# Altium schematic sheet USBC_Hub1.SchDoc
size A3; SheetNumber: 1; SheetTotal: 4
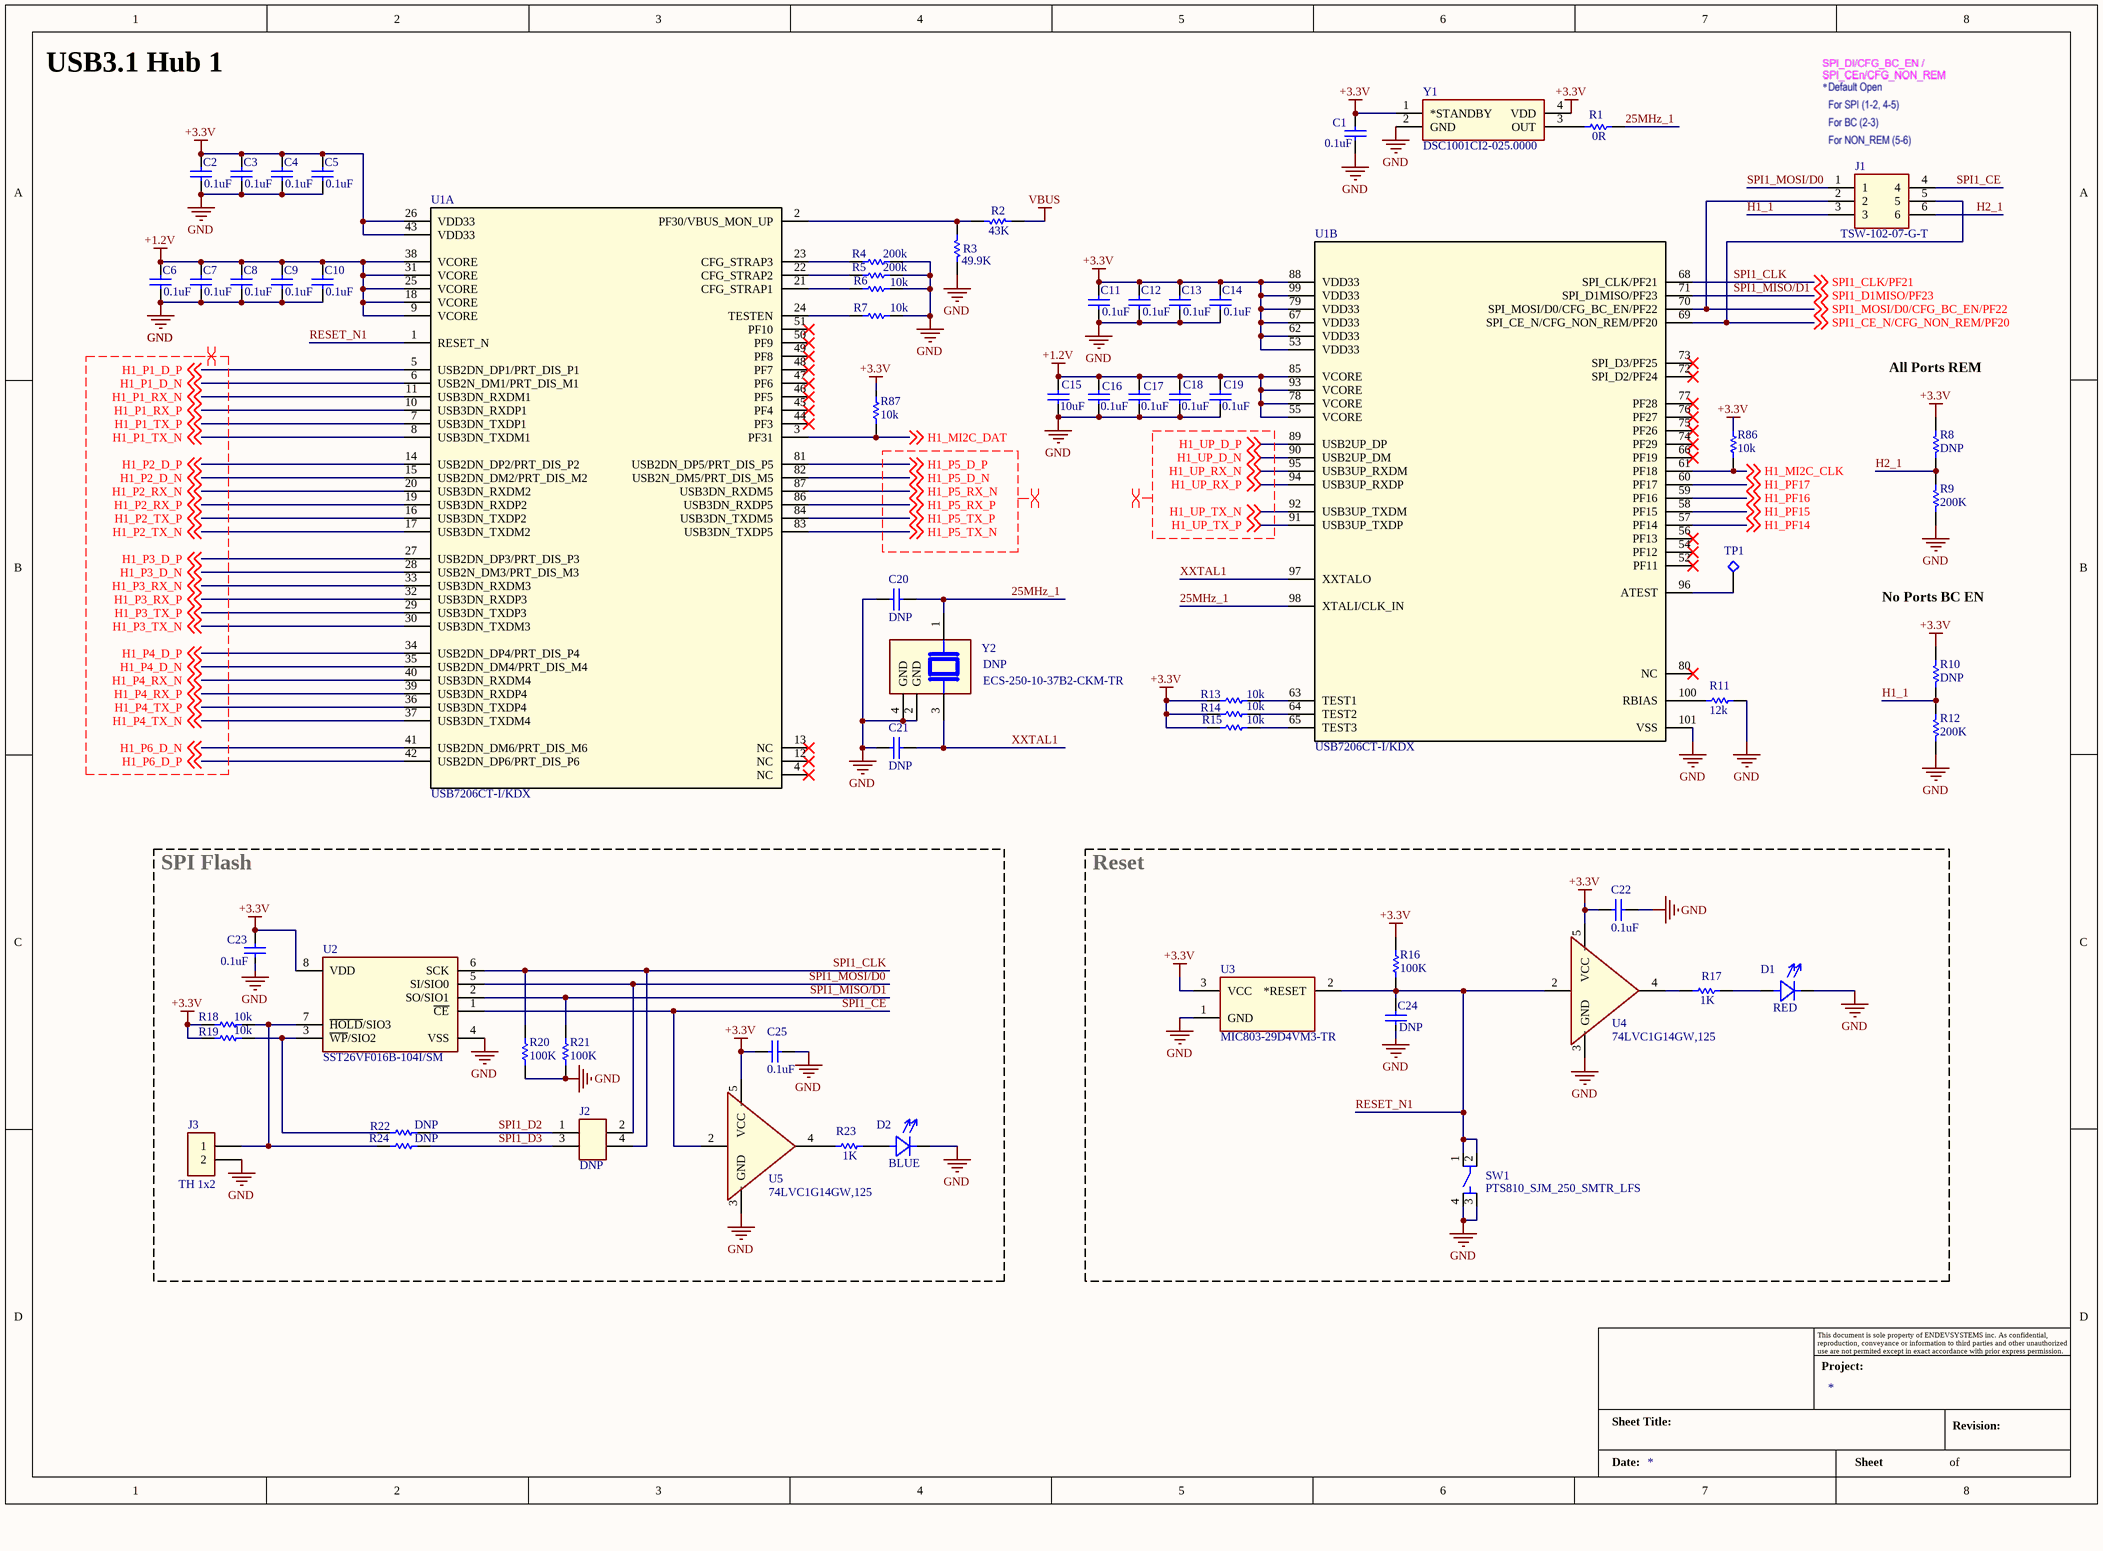
[diagram p0: USBC_Hub1.SchDoc]

## Parts
?  Title_Block  (value not drawn)  (graphical)
C1  0.1uF  [C-0402/1005]
C2  0.1uF  [C-0402/1005]
C3  0.1uF  [C-0402/1005]
C4  0.1uF  [C-0402/1005]
C5  0.1uF  [C-0402/1005]
C6  0.1uF  [C-0402/1005]
C7  0.1uF  [C-0402/1005]
C8  0.1uF  [C-0402/1005]
C9  0.1uF  [C-0402/1005]
C10  0.1uF  [C-0402/1005]
C11  0.1uF  [C-0402/1005]
C12  0.1uF  [C-0402/1005]
C13  0.1uF  [C-0402/1005]
C14  0.1uF  [C-0402/1005]
C15  10uF  [C-0805/2012]
C16  0.1uF  [C-0402/1005]
C17  0.1uF  [C-0402/1005]
C18  0.1uF  [C-0402/1005]
C19  0.1uF  [C-0402/1005]
C20  DNP  [R-0402/1005]
C21  DNP  [R-0402/1005]
C22  0.1uF  [C-0402/1005]
C23  0.1uF  [C-0402/1005]
C24  value DNP  [C-0402/1005]  (hidden comment: 0.1uF)
C25  0.1uF  [C-0402/1005]
D1  RED  [LEDC1608X65N]
D2  BLUE  [LEDC1608X65N]
J1  TSW-102-07-G-T  [CON6_3X2_TU_TSW_SAI]
J2  DNP  [PIN HEADER 2x2 2.54mm]
J3  TH 1x2  [PIN HEADER 1x2 2.54mm]
R1  0R  [R-0402/1005]
R2  43K  [R-0402/1005]
R3  49.9K  [R-0402/1005]
R4  200k  [R-0402/1005]
R5  200k  [R-0402/1005]
R6  10k  [R-0402/1005]
R7  10k  [R-0402/1005]
R8  DNP  [R-0402/1005]
R9  200K  [R-0402/1005]
R10  DNP  [R-0402/1005]
R11  12k  [R-0402/1005]
R12  200K  [R-0402/1005]
R13  10k  [R-0402/1005]
R14  10k  [R-0402/1005]
R15  10k  [R-0402/1005]
R16  100K  [R-0402/1005]
R17  1K  [R-0402/1005]
R18  10k  [R-0402/1005]
R19  10k  [R-0402/1005]
R20  100K  [R-0402/1005]
R21  100K  [R-0402/1005]
R22  DNP  [R-0402/1005]
R23  1K  [R-0402/1005]
R24  DNP  [R-0402/1005]
R86  10k  [R-0402/1005]
R87  10k  [R-0402/1005]
SW1  PTS810_SJM_250_SMTR_LFS  [SW_PTS810_SJM_250_SMTR_LFS]
TP1  Test Points  [Test Point TH Round H0.9,D1.6]  (value not drawn)
U1  USB7206CT-I/KDX  [USB7206]  (parts A,B of 2)
U2  SST26VF016B-104I/SM  [SOIC127P794X203-8N]
U3  MIC803-29D4VM3-TR  [SOT-23_M3_MCH]
U4  74LVC1G14GW,125  [SOT65P212X110-5N]
U5  74LVC1G14GW,125  [SOT65P212X110-5N]
Y1  DSC1001CI2-025.0000  [CDFN4_3P2X2P5_MCH]
Y2  DNP  [ECS-250-10-37B2]

## Blocks framed on the sheet
SPI Flash: C23 C25 D2 J2 J3 R18-R24 U2 U5
Reset: C22 C24 D1 R16 R17 SW1 U3 U4

## Nets
+1.2V: C6.2 C7.2 C8.2 C9.2 C10.2 C15.2 C16.1 C17.1 C18.2 C19.2 U1.9(VCORE) U1.18(VCORE) U1.25(VCORE) U1.31(VCORE) U1.38(VCORE) U1.55(VCORE) U1.78(VCORE) U1.85(VCORE) U1.93(VCORE)
+3.3V: C1.2 C2.2 C3.2 C4.2 C5.2 C11.2 C12.2 C13.2 C14.2 C22.2 C23.2 C25.2 R8.2 R10.2 R13.2 R14.2 R15.2 R16.1 R18.2 R19.2 R86.1 R87.1 U1.26(VDD33) U1.43(VDD33) U1.53(VDD33) U1.62(VDD33) U1.67(VDD33) U1.79(VDD33) U1.88(VDD33) U1.99(VDD33) U2.8(VDD) U3.3(VCC) U4.5(VCC) U5.5(VCC) Y1.1(*STANDBY) Y1.4(VDD)
GND: C1.1 C2.1 C3.1 C4.1 C5.1 C6.1 C7.1 C8.1 C9.1 C10.1 C11.1 C12.1 C13.1 C14.1 C15.1 C16.2 C17.2 C18.1 C19.1 C20.2 C21.2 C22.1 C23.1 C24.1 C25.1 D1.C D2.C J3.2 R3.2 R4.2 R5.2 R6.2 R7.1 R9.1 R11.1 R12.1 R20.2 R21.2 SW1.3 SW1.4 U1.101(VSS) U2.4(VSS) U3.1(GND) U4.3(GND) U5.3(GND) Y1.2(GND) Y2.2(GND) Y2.4(GND)
VBUS: R2.2
25MHz_1: C20.1 R1.2 U1.98(XTALI/CLK_IN) Y2.1
H1_1: J1.3 R10.1 R12.2
H1_MI2C_CLK: R86.2 U1.61(PF18) ; off-sheet H1_MI2C_CLK
H1_MI2C_DAT: R87.2 U1.3(PF31) ; off-sheet H1_MI2C_DAT
H1_P1_D_N: U1.6(USB2N_DM1/PRT_DIS_M1) ; off-sheet H1_P1_D_N
H1_P1_D_P: U1.5(USB2DN_DP1/PRT_DIS_P1) ; off-sheet H1_P1_D_P
H1_P1_RX_N: U1.11(USB3DN_RXDM1) ; off-sheet H1_P1_RX_N
H1_P1_RX_P: U1.10(USB3DN_RXDP1) ; off-sheet H1_P1_RX_P
H1_P1_TX_N: U1.8(USB3DN_TXDM1) ; off-sheet H1_P1_TX_N
H1_P1_TX_P: U1.7(USB3DN_TXDP1) ; off-sheet H1_P1_TX_P
H1_P2_D_N: U1.15(USB2DN_DM2/PRT_DIS_M2) ; off-sheet H1_P2_D_N
H1_P2_D_P: U1.14(USB2DN_DP2/PRT_DIS_P2) ; off-sheet H1_P2_D_P
H1_P2_RX_N: U1.20(USB3DN_RXDM2) ; off-sheet H1_P2_RX_N
H1_P2_RX_P: U1.19(USB3DN_RXDP2) ; off-sheet H1_P2_RX_P
H1_P2_TX_N: U1.17(USB3DN_TXDM2) ; off-sheet H1_P2_TX_N
H1_P2_TX_P: U1.16(USB3DN_TXDP2) ; off-sheet H1_P2_TX_P
H1_P3_D_N: U1.28(USB2N_DM3/PRT_DIS_M3) ; off-sheet H1_P3_D_N
H1_P3_D_P: U1.27(USB2DN_DP3/PRT_DIS_P3) ; off-sheet H1_P3_D_P
H1_P3_RX_N: U1.33(USB3DN_RXDM3) ; off-sheet H1_P3_RX_N
H1_P3_RX_P: U1.32(USB3DN_RXDP3) ; off-sheet H1_P3_RX_P
H1_P3_TX_N: U1.30(USB3DN_TXDM3) ; off-sheet H1_P3_TX_N
H1_P3_TX_P: U1.29(USB3DN_TXDP3) ; off-sheet H1_P3_TX_P
H1_P4_D_N: U1.35(USB2DN_DM4/PRT_DIS_M4) ; off-sheet H1_P4_D_N
H1_P4_D_P: U1.34(USB2DN_DP4/PRT_DIS_P4) ; off-sheet H1_P4_D_P
H1_P4_RX_N: U1.40(USB3DN_RXDM4) ; off-sheet H1_P4_RX_N
H1_P4_RX_P: U1.39(USB3DN_RXDP4) ; off-sheet H1_P4_RX_P
H1_P4_TX_N: U1.37(USB3DN_TXDM4) ; off-sheet H1_P4_TX_N
H1_P4_TX_P: U1.36(USB3DN_TXDP4) ; off-sheet H1_P4_TX_P
H1_P5_D_N: U1.82(USB2N_DM5/PRT_DIS_M5) ; off-sheet H1_P5_D_N
H1_P5_D_P: U1.81(USB2DN_DP5/PRT_DIS_P5) ; off-sheet H1_P5_D_P
H1_P5_RX_N: U1.87(USB3DN_RXDM5) ; off-sheet H1_P5_RX_N
H1_P5_RX_P: U1.86(USB3DN_RXDP5) ; off-sheet H1_P5_RX_P
H1_P5_TX_N: U1.83(USB3DN_TXDP5) ; off-sheet H1_P5_TX_N
H1_P5_TX_P: U1.84(USB3DN_TXDM5) ; off-sheet H1_P5_TX_P
H1_P6_D_N: U1.41(USB2DN_DM6/PRT_DIS_M6) ; off-sheet H1_P6_D_N
H1_P6_D_P: U1.42(USB2DN_DP6/PRT_DIS_P6) ; off-sheet H1_P6_D_P
H1_PF14: U1.57(PF14) ; off-sheet H1_PF14
H1_PF15: U1.58(PF15) ; off-sheet H1_PF15
H1_PF16: U1.59(PF16) ; off-sheet H1_PF16
H1_PF17: U1.60(PF17) ; off-sheet H1_PF17
H1_UP_D_N: U1.90(USB2UP_DM) ; off-sheet H1_UP_D_N
H1_UP_D_P: U1.89(USB2UP_DP) ; off-sheet H1_UP_D_P
H1_UP_RX_N: U1.95(USB3UP_RXDM) ; off-sheet H1_UP_RX_N
H1_UP_RX_P: U1.94(USB3UP_RXDP) ; off-sheet H1_UP_RX_P
H1_UP_TX_N: U1.92(USB3UP_TXDM) ; off-sheet H1_UP_TX_N
H1_UP_TX_P: U1.91(USB3UP_TXDP) ; off-sheet H1_UP_TX_P
H2_1: J1.6 R8.1 R9.2
RESET_N1: C24.2 R16.2 SW1.1 SW1.2 U1.1(RESET_N) U3.2(*RESET) U4.2(A)
SPI1_CE: J1.4 U2.1(~{CE}) U5.2(A)
SPI1_CE_N/CFG_NON_REM/PF20: J1.5 U1.69(SPI_CE_N/CFG_NON_REM/PF20) ; off-sheet SPI1_CE_N/CFG_NON_REM/PF20
SPI1_CLK: J2.4 R20.1 U1.68(SPI_CLK/PF21) U2.6(SCK) ; off-sheet SPI1_CLK/PF21  [also labelled SPI1_CLK/PF21]
SPI1_D2: J2.1 R22.2
SPI1_D3: J2.3 R24.2
SPI1_MISO/D1: R21.1 U1.71(SPI_D1MISO/PF23) U2.2(SO/SIO1) ; off-sheet SPI1_D1MISO/PF23  [also labelled SPI1_D1MISO/PF23]
SPI1_MOSI/D0: J1.1 J2.2 U2.5(SI/SIO0)
SPI1_MOSI/D0/CFG_BC_EN/PF22: J1.2 U1.70(SPI_MOSI/D0/CFG_BC_EN/PF22) ; off-sheet SPI1_MOSI/D0/CFG_BC_EN/PF22
XXTAL1: C21.1 U1.97(XXTALO) Y2.3
NetD1_A: D1.A R17.1
NetD2_A: D2.A R23.1
NetJ3_1: J3.1 R18.1 R24.1 U2.7(~{HOLD}/SIO3)
NetR1_1: R1.1 Y1.3(OUT)
NetR2_1: R2.1 R3.1 U1.2(PF30/VBUS_MON_UP)
NetR4_1: R4.1 U1.23(CFG_STRAP3)
NetR5_1: R5.1 U1.22(CFG_STRAP2)
NetR6_1: R6.1 U1.21(CFG_STRAP1)
NetR7_2: R7.2 U1.24(TESTEN)
NetR11_2: R11.2 U1.100(RBIAS)
NetR13_1: R13.1 U1.63(TEST1)
NetR14_1: R14.1 U1.64(TEST2)
NetR15_1: R15.1 U1.65(TEST3)
NetR17_2: R17.2 U4.4(~{Y})
NetR19_1: R19.1 R22.1 U2.3(~{WP}/SIO2)
NetR23_2: R23.2 U5.4(~{Y})
NetTP1_1: TP1.1 U1.96(ATEST)

Not connected (* = marked no-connect by the designer): U1 4(NC)* 12(NC)* 13(NC)* 44(PF3)* 45(PF4)* 46(PF5)* 47(PF6)* 48(PF7)* 49(PF8)* 50(PF9)* 51(PF10)* 52(PF11)* 54(PF12)* 56(PF13)* 66(PF19)* 72(SPI_D2/PF24)* 73(SPI_D3/PF25)* 74(PF29)* 75(PF26)* 76(PF27)* 77(PF28)* 80(NC)*

## Layout directives
differential pair; differential pair class Diff_90R: H1_P1_D_N, H1_P1_D_P, H1_P1_RX_N, H1_P1_RX_P, H1_P1_TX_N, H1_P1_TX_P, H1_P2_D_N, H1_P2_D_P, H1_P2_RX_N, H1_P2_RX_P, H1_P2_TX_N, H1_P2_TX_P, H1_P3_D_N, H1_P3_D_P, H1_P3_RX_N, H1_P3_RX_P, H1_P3_TX_N, H1_P3_TX_P, H1_P4_D_N, H1_P4_D_P, H1_P4_RX_N, H1_P4_RX_P, H1_P4_TX_N, H1_P4_TX_P, H1_P5_D_N, H1_P5_D_P, H1_P5_RX_N, H1_P5_RX_P, H1_P5_TX_N, H1_P5_TX_P, H1_P6_D_N, H1_P6_D_P, H1_UP_D_N, H1_UP_D_P, H1_UP_RX_N, H1_UP_RX_P, H1_UP_TX_N, H1_UP_TX_P

## Notes on the sheet
- USB3.1 Hub 1
- All Ports REM
- No Ports BC EN
- (in symbol Title_Block) This document is sole property of ENDEVSYSTEMS inc. As confidential, reproduction, conveyance or information to third parties and other unauthorized use are not permited except in exact accordance with prior express permission.; Project:; Sheet Title:; Revision:; Date:; Sheet; of

## Library data of the parts
C1-C19 C22-C25 = Cap: Capacitor; Published: 8-Jun-2000; LatestRevisionDate: 17-Jul-2002; LatestRevisionNote: Re-released for DXP Platform.; PackageReference: RAD-0.3; Publisher: Altium Limited; PackageDescription: Radial Cap, Thru-Hole; 2 Leads; 0.3 in Pin Spacing
  C1-C14 C16-C19 C22 C23 C25: Value: 0.1uF
  C15: Value: 10uF
C20 C21 = Cap: Capacitor; Value: 0.1uF; Published: 8-Jun-2000; LatestRevisionDate: 17-Jul-2002; LatestRevisionNote: Re-released for DXP Platform.; PackageReference: RAD-0.3; Publisher: Altium Limited; PackageDescription: Radial Cap, Thru-Hole; 2 Leads; 0.3 in Pin Spacing
D1 D2 = Diode-LED: Supplier: Digikey Electronics
J1 = TSW-102-07-G-T: No Description Available; Mfr_Name: Samtec Inc; Copyright: Copyright (C) 2023 Ultra Librarian. All rights reserved.; Manufacturer_Part_Number: TSW-102-07-G-T; Digi-Key_Part_Number_1: TSW-102-07-G-T-ND; RefDes: RefDes; Type: DEV
J2 = Header 2x2: FIXED IND 22UH 620MA 350 MOHM; Mfr. Part No.: PH2-04-UA; Unit Price (USD): 0.1; Supplier Part No.: 2057-PH2-04-UA-ND; Supplier: Digikey Electronics
J3 = Header 1x2: CONN HEADER VERT 3POS 2.54MM; Mfr. Part No.: 75160-156-03LF; Value: 51R; Unit Price (USD): 0.74; Supplier Part No.: 609-75160-156-03LF-ND; Supplier: Digikey Electronics
R1 R22 R24 = Res1: Resistor; Value: 200K; Published: 8-Jun-2000; LatestRevisionDate: 17-Jul-2002; LatestRevisionNote: Re-released for DXP Platform.; PackageReference: AXIAL-0.3; Publisher: Altium Limited; PackageDescription: Axial Device, Thru-Hole; 2 Leads; 0.3 in Pin Spacing
R2 R3 R8-R12 R16 R17 R20 R21 R23 = Res1: Resistor; Value: 10K; Published: 8-Jun-2000; LatestRevisionDate: 17-Jul-2002; LatestRevisionNote: Re-released for DXP Platform.; PackageReference: AXIAL-0.3; Publisher: Altium Limited; PackageDescription: Axial Device, Thru-Hole; 2 Leads; 0.3 in Pin Spacing
R4-R7 R13-R15 R18 R19 R86 R87 = Res1: Resistor; Published: 8-Jun-2000; LatestRevisionDate: 17-Jul-2002; LatestRevisionNote: Re-released for DXP Platform.; PackageReference: AXIAL-0.3; Publisher: Altium Limited; PackageDescription: Axial Device, Thru-Hole; 2 Leads; 0.3 in Pin Spacing
  R4 R5: Value: 200K
  R6 R7 R13-R15 R18 R19 R86 R87: Value: 10K
SW1 = PTS810_SJM_250_SMTR_LFS: Tactile Switch SPST-NO Top Actuated Surface Mount; MF: C&K; MP: PTS810 SJM 250 SMTR LFS; Price: None; Package: None; Availability: Unavailable; Value: *; SnapEDA_Link: https://www.snapeda.com/parts/PTS810%20SJM%20250%20SMTR%20LFS/C%26K/view-part/522770/?ref=snap
U1 = USB7206: IC USB3.1 GEN2 HUB TYPE C; Manufacturer: Microchip Technology; Manufacturer Product Number: USB7206CT-I/KDX; Digi-Key Part Number: 150-USB7206CT-I/KDXTR-ND; Unit Price: $12.9; Stock: 4935
U3 = MIC803-29D4VM3-TR: No Description Available; Mfr_Name: Microchip; Copyright: Copyright (C) 2023 Ultra Librarian. All rights reserved.; Manufacturer_Part_Number: MIC803-29D4VM3-TR; Digi-Key_Part_Number_1: 576-3806-1-ND; Digi-Key_Part_Number_2: 576-3806-2-ND; Digi-Key_Part_Number_3: 576-3806-6-ND; RefDes: RefDes; Type: DEV
U4 U5 = 74LVC1G14GW,125: Inverter Schmitt Trigger 1-Element CMOS 5-Pin TSSOP T/R; Price: None; Availability: Unavailable; MP: 74LVC1G14GW,125; Value: *; Package: None
Y1 = DSC1001CI2-025.0000: No Description Available; Mfr_Name: Microchip; Copyright: Copyright (C) 2023 Ultra Librarian. All rights reserved.; Manufacturer_Part_Number: DSC1001CI2-025.0000; Digi-Key_Part_Number_1: 576-4957-5-ND; RefDes: RefDes; Type: DEV
Y2 = ECS-250-10-37B2-CKM-TR: Parameter 1: ECS-250-10-37B2-CKM-TR
? = Title_Block: Date:: *; Project:: *